# EasyEDA Pro project 鲲FOC无刷电机控制器.epro, schematic 驱动板
Create Date: 2023-12-31; Page Name: P1; Project Name: 鲲FOC无刷电机控制器（已适配灯哥开源FOC程序）; Schematic Name: 驱动板; Update Date: 2024-01-07; Company: 嘉立创EDA; Page Size: A4; Version: V1.0
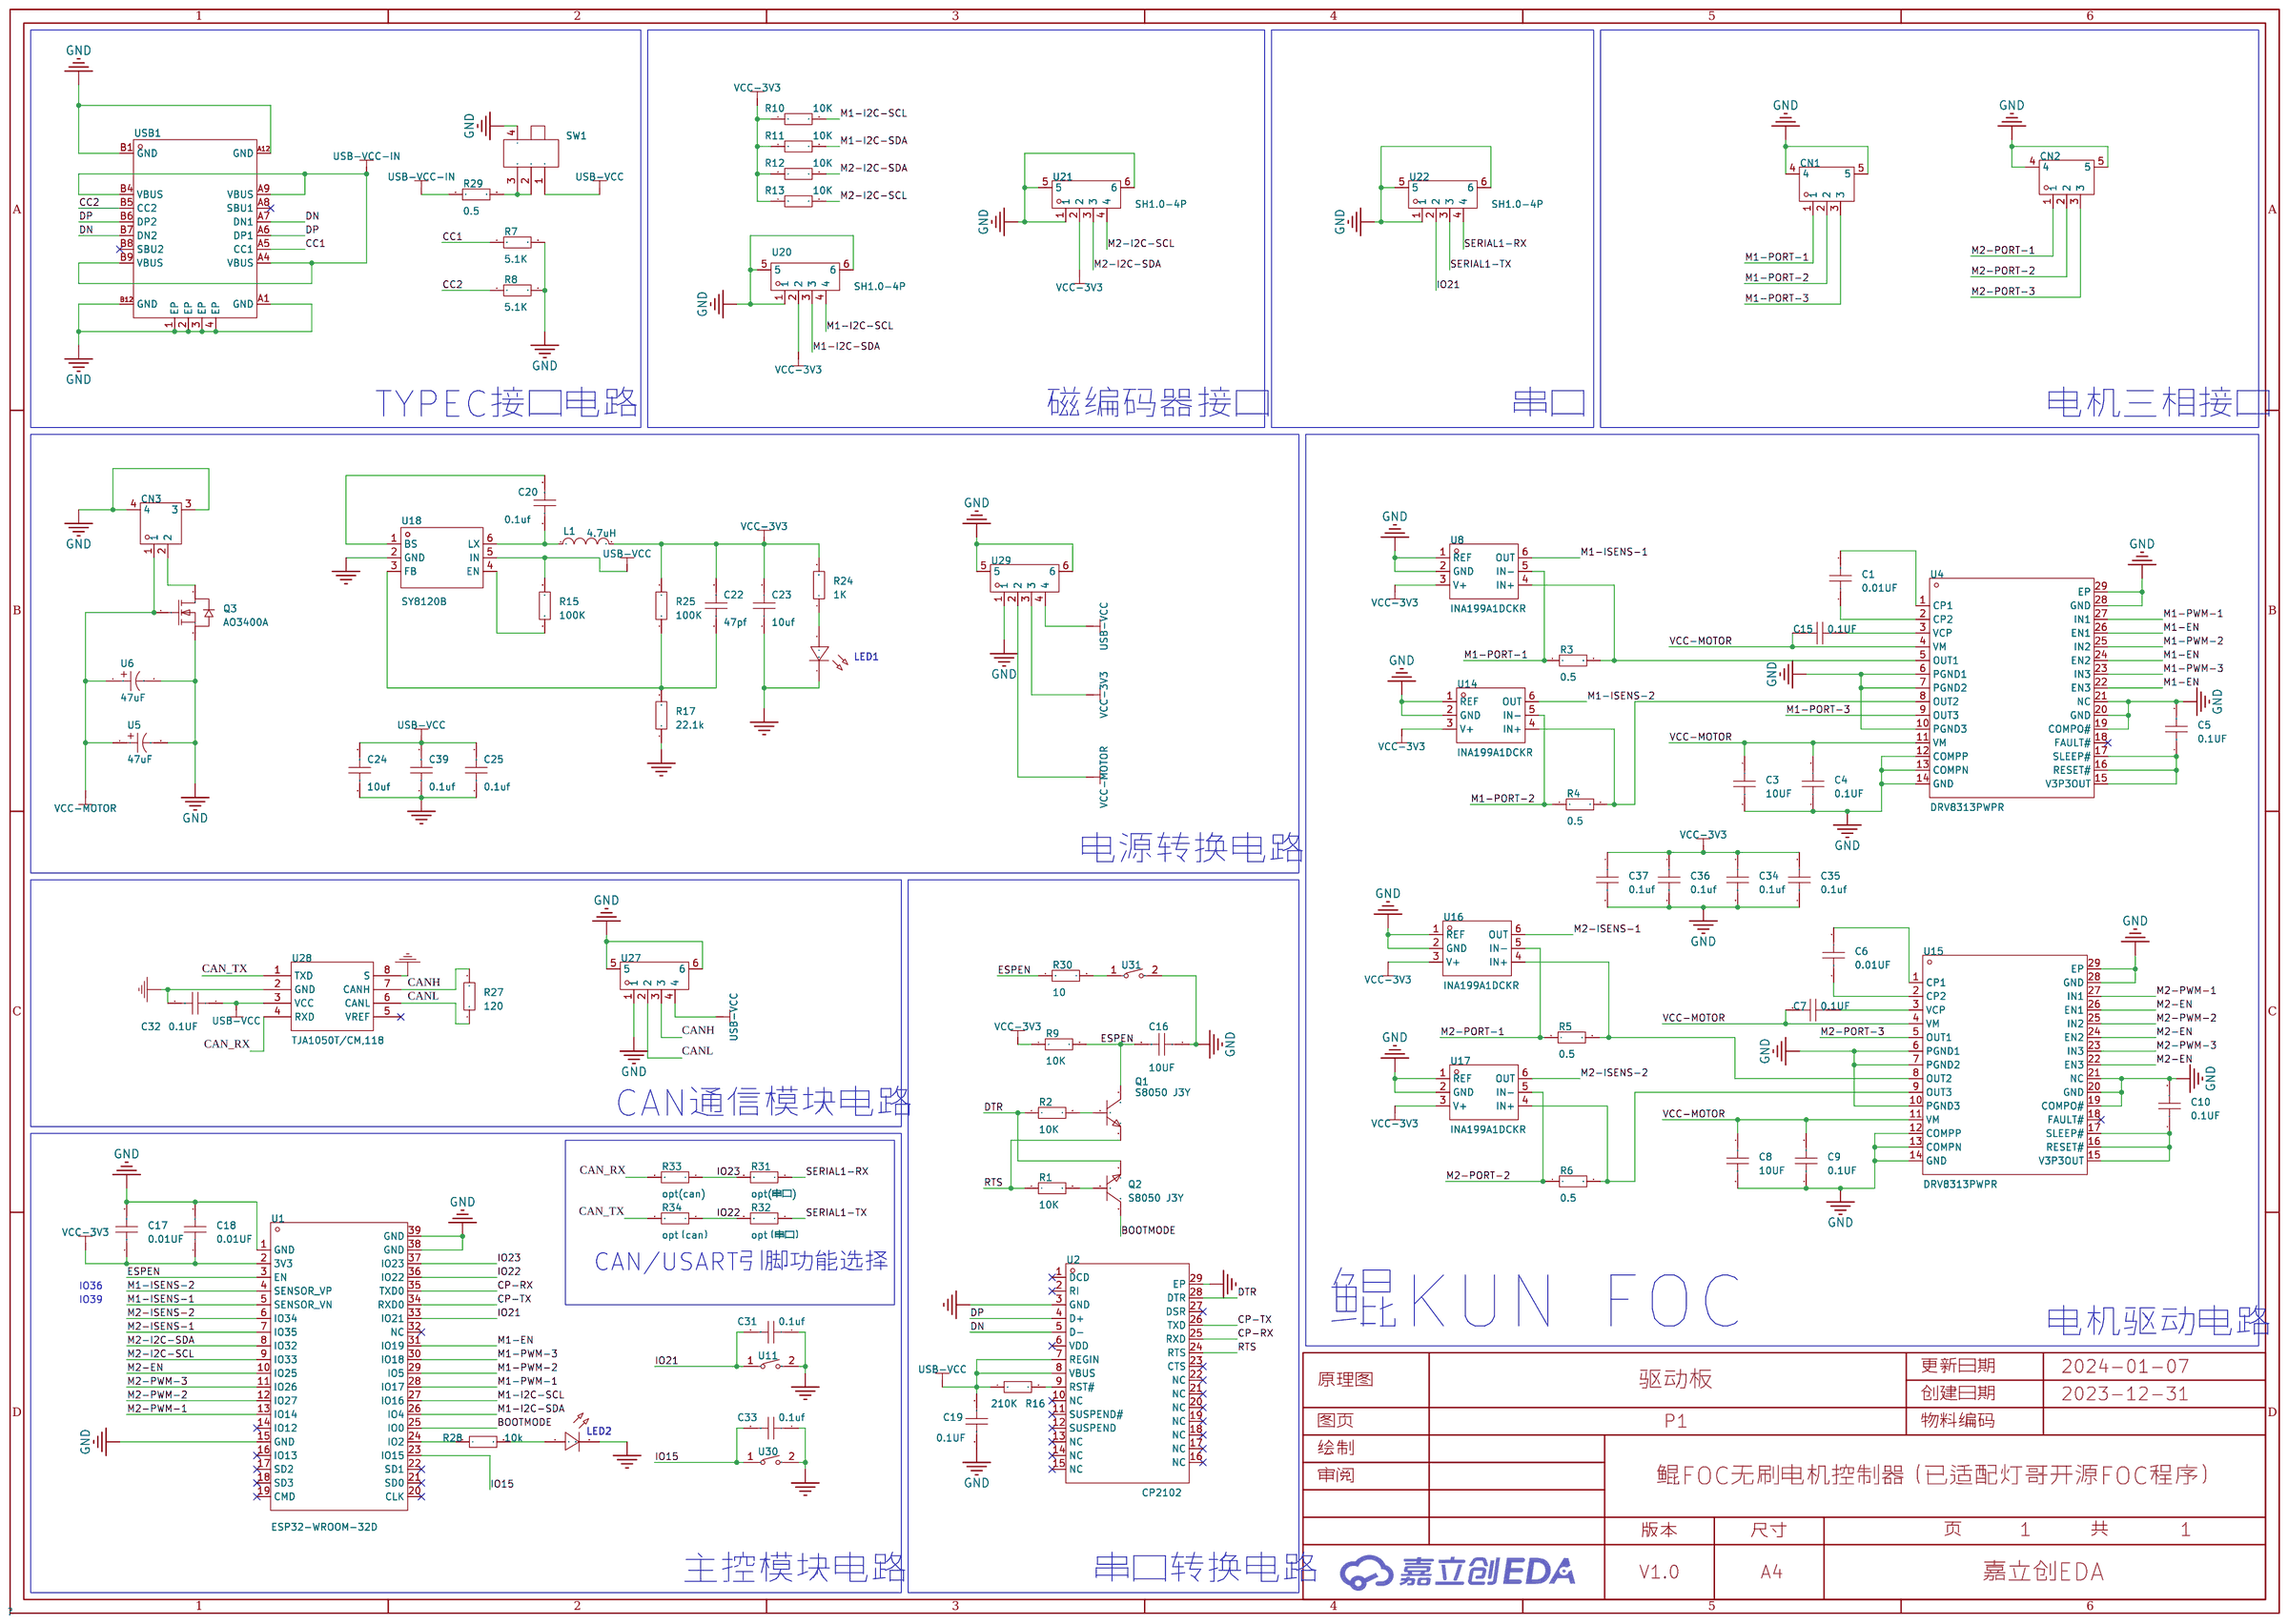
[diagram p1: schematic sheet]

## Parts
C1  0.01UF  [C0603]
C3  10UF  [C0603]
C4  0.1UF  [C0603]
C5  0.1UF  [C0603]
C6  0.01UF  [C0603]
C7  0.1UF  [C0603]
C8  10UF  [C0603]
C9  0.1UF  [C0603]
C10  0.1UF  [C0603]
C15  0.1UF  [C0603]
C16  10UF  [C0603]
C17  0.01UF  [C0603]
C18  0.01UF  [C0603]
C19  0.1UF  [C0603]
C20  0.1uf  [C0603]
C22  47pf  [C0603]
C23  10uf  [C0603]
C24  10uf  [C0603]
C25  0.1uf  [C0603]
C31  0.1uf  [C0603]
C32  0.1UF  [C0603]
C33  0.1uf  [C0603]
C34  0.1uf  [C0603]
C35  0.1uf  [C0603]
C36  0.1uf  [C0603]
C37  0.1uf  [C0603]
C39  0.1uf  [C0603]
CN1  MR30PW-F  [CONN-TH_MR30PW-F]
CN2  MR30PW-F  [CONN-TH_MR30PW-F]
CN3  XT30PW-M  [CONN-TH_XT30PW-M]
L1  4.7uH  [IND-SMD_L4.0-W4.0_FNR40XXS]
LED1  -  [LED_0603]
LED2  -  [LED_0603]
Q1  S8050 J3Y  [SOT-23-3_L3.0-W1.7-P0.95-LS2.9-BR]
Q2  S8050 J3Y  [SOT-23-3_L3.0-W1.7-P0.95-LS2.9-BR]
Q3  AO3400A  [SOT-23-3_L2.9-W1.6-P1.90-LS2.8-BR]
R1  10K  [R0603]
R2  10K  [R0603]
R3  0.5  [R1206]
R4  0.5  [R1206]
R5  0.5  [R1206]
R6  0.5  [R1206]
R7  5.1K  [R0603]
R8  5.1K  [R0603]
R9  10K  [R0603]
R10  10K  [R0603]
R11  10K  [R0603]
R12  10K  [R0603]
R13  10K  [R0603]
R15  100K  [R0603]
R16  210K  [R0603]
R17  22.1k  [R0603]
R24  1K  [R0603]
R25  100K  [R0603]
R27  120  [R0603]
R28  10k  [R0603]
R29  0.5  [R1206]
R30  10  [R0603]
R31  opt(串口)  [R0603]
R32  opt（串口）  [R0603]
R33  opt(can)  [R0603]
R34  opt（can）  [R0603]
SW1  MK-12C01-G1.5  [SW-SMD_DEALON_MK-12C01-G1.5]
U1  ESP32-WROOM-32D  [WIFIM-SMD_ESP32-WROOM-32D]
U2  CP2102  [QFN-28_L5.0-W5.0-P0.50-TL-EP3.2]
U4  DRV8313PWPR  [HTSSOP-28_L9.8-W4.5-P0.65-LS6.6-BL-EP]
U5  47uF  [cap-smd_bd5.0-l5.3-w5.3-ls5.7-fd]
U6  47uF  [cap-smd_bd5.0-l5.3-w5.3-ls5.7-fd]
U8  INA199A1DCKR  [SC-70-6_L2.0-W1.3-P0.65-LS2.1-BR]
U11  TC-S3403-2.0-260G  [SW-SMD_L4.0-W3.0-LS5.0]
U14  INA199A1DCKR  [SC-70-6_L2.0-W1.3-P0.65-LS2.1-BR]
U15  DRV8313PWPR  [HTSSOP-28_L9.8-W4.5-P0.65-LS6.6-BL-EP]
U16  INA199A1DCKR  [SC-70-6_L2.0-W1.3-P0.65-LS2.1-BR]
U17  INA199A1DCKR  [SC-70-6_L2.0-W1.3-P0.65-LS2.1-BR]
U18  SY8120B  [SOT-23-6_L2.9-W1.6-P0.95-LS2.8-BL]
U20  SH1.0-4P  [CONN-SMD_4P-P1.00_SH1.0-4P]
U21  SH1.0-4P  [CONN-SMD_4P-P1.00_SH1.0-4P]
U22  SH1.0-4P  [CONN-SMD_4P-P1.00_SH1.0-4P]
U27  SH1.0-4P  [CONN-SMD_4P-P1.00_SH1.0-4P]
U28  TJA1050T/CM,118  [SOIC-8_L5.0-W4.0-P1.27-LS6.0-BL]
U29  SH1.0-4P  [CONN-SMD_4P-P1.00_SH1.0-4P]
U30  TC-S3403-2.0-260G  [SW-SMD_L4.0-W3.0-LS5.0]
U31  TC-S3403-2.0-260G  [SW-SMD_L4.0-W3.0-LS5.0]
USB1  HC-TYPE-C-16P-01B  [USB-C-SMD_KH-TYPE-C-16P]

## Library data of the parts
C1 C3-C10 C15-C20 C22-C25 C31-C37 C39 = CAP_0805: Supplier Footprint: 0805
CN1 CN2 = MR30PW-F: Supplier Part: C2928110; Supplier Footprint: Through hole; JLCPCB Part Class: 扩展库; Supplier: LCSC
CN3 = XT30PW-M: Socket,DCsupply,XT30,male,PIN:2; LCSC Part Name: AMASS(艾迈斯)航模插头 卧式弯脚 XT30PW-M公头; Supplier Part: C431092; Manufacturer: AMASS(艾迈斯); JLCPCB Part Class: 扩展库; Datasheet: https://atta.szlcsc.com/upload/public/pdf/source/20220222/6A9F22F7850E25B33E1BE430ADF8560B.pdf; Supplier: LCSC
L1 = FNR4020S4R7MT: 电感值:4.7uH;精度:±20%;额定电流:1.34A;直流电阻(DCR):98mΩ;; LCSC Part Name: 4.7uH ±20% 1.34A 98mΩ; Supplier Part: C167828; Manufacturer: cjiang(长江微电); Supplier Footprint: SMD,4x4x2mm; JLCPCB Part Class: 扩展库; Datasheet: https://atta.szlcsc.com/upload/public/pdf/source/20190327/C167828_0C146B75E465FFC746F4145E84B3A0D4.pdf; Supplier: LCSC; Tolerance: ±20%; Rated Current: 1.34A; DC Resistance (DCR): 98mΩ
LED1 LED2 = LED_0603-G: Supplier Footprint: 0603
Q1 Q2 = S8050 J3Y_C2146: 晶体管类型:NPN;集射极击穿电压(Vceo):25V;集电极电流(Ic):500mA;功率(Pd):300mW;直流电流增益(hFE@Ic,Vce):200@50mA,1V;; LCSC Part Name: NPN 25V 500mA (200-350); Supplier Part: C2146; Manufacturer: CJ(江苏长电/长晶); Supplier Footprint: SOT-23; JLCPCB Part Class: 基础库; Datasheet: https://atta.szlcsc.com/upload/public/pdf/source/20140809/1457707209234.pdf; Supplier: LCSC; Transistor Type: NPN; Collector-Emitter Breakdown Voltage (Vceo): 25V; Collector Current (Ic): 500mA; Power Dissipation (Pd): 300mW; Collector Cut-Off Current (Icbo): 100nA; Collector-Emitter Saturation Voltage (VCE(sat)@Ic,Ib): 600mV@500mA,50mA; DC Current Gain (hFE@Ic,Vce): 200@50mA,1V; Transition Frequency (fT): 150MHz; Operating Temperature: +150℃@(Tj)
Q3 = AO3400A_C20917: 类型:N沟道;漏源电压(Vdss):30V;连续漏极电流(Id):5.7A;功率(Pd):1.4W;导通电阻(RDS(on)@Vgs,Id):26.5mΩ@10V,5.7A;; LCSC Part Name: N沟道 30V 5.7A; Supplier Part: C20917; Manufacturer: AOS; Supplier Footprint: SOT-23-3L; JLCPCB Part Class: 基础库; Datasheet: https://atta.szlcsc.com/upload/public/pdf/source/20140107/1457706668533.pdf; Supplier: LCSC; Type: N沟道; Drain Source Voltage (Vdss): 30V; Continuous Drain Current (Id): 5.7A; Power Dissipation (Pd): 1.4W; Drain Source On Resistance (RDS(on)@Vgs,Id): 26.5mΩ@10V,5.7A; Gate Threshold Voltage (Vgs(th)@Id): 1.5V@250uA
R1 R2 R7-R13 R15 R17 R24 R25 R27 R28 R30-R34 = Res_0805: Supplier Footprint: 0805
R3-R6 R29 = Res_1206: Supplier Footprint: 1206
R16 = Res_0603: Supplier Footprint: 0603
SW1 = MK-12C01-G1.5: LCSC Part Name: 微型拨动开关; Supplier Part: C2904924; Manufacturer: DEALON(德艺隆); Supplier Footprint: SMD; Datasheet: https://atta.szlcsc.com/upload/public/pdf/source/20220901/95C663E2ADD105B13B25A040498EDC42.pdf; Supplier: LCSC
U1 = ESP32-WROOM-32D: Supplier Part: C503588; Supplier Footprint: Module; Datasheet: https://atta.szlcsc.com/upload/public/pdf/source/20200407/C503588_9E920733859C3E86D4243CAB277EC877.pdf; Supplier: LCSC
U2 = CP2102: Supplier Part: C9900004371; Supplier Footprint: QFN-28_L5.0-W5.0-P0.50-EP3.2; JLCPCB Part Class: Extended Part; Supplier: LCSC
U4 U15 = DRV8313PWPR: 类型:无刷直流BLDC;电源电压:8V~60V;输出电流:-;接口:并行;; Supplier Part: C92482; Manufacturer: TI(德州仪器); Supplier Footprint: HTSSOP-28-EP-4.5mm; JLCPCB Part Class: 扩展库; Datasheet: https://atta.szlcsc.com/upload/public/pdf/source/20180307/C92482_15204091381071407760.pdf; Supplier: LCSC; Type: 无刷直流BLDC; Supply Voltage: 8V~60V; Interface: 并行; Operating Temperature: -40℃~+150℃@(Tj)
U5 U6 = UUL1C220MCL1GS: 容值:22uF;精度:±20%;额定电压:16V;电容体直径:5mm;电容体长度:5.8mm;纹波电流:30mA@120Hz;等效串联电阻:-;工作寿命:5000hrs@105℃;工作温度:-40℃~+105℃;; LCSC Part Name: 22uF ±20% 16V; Supplier Part: C2162916; Manufacturer: Nichicon(尼吉康); Supplier Footprint: SMD,D5xL5.8mm; JLCPCB Part Class: Extended Part; Datasheet: https://atta.szlcsc.com/upload/public/pdf/source/20211025/5FD45B81DB3BCF3AFF7B715067C047C8.pdf; Supplier: LCSC; Tolerance: ±20%; Rated Voltage: 16V; φD: 5mm; L: 5.8mm; Ripple Current: 30mA@120Hz; Lifetime @ Temp: 5000hrs@105℃; Operating Temperature: -40℃~+105℃
U8 U14 U16 U17 = INA199B1DCKR: INA199 26V、双向、零漂移、低侧/高侧、电压输出分流监控器; Supplier Part: C398920; Manufacturer: TI(德州仪器); Supplier Footprint: SC-70-6; JLCPCB Part Class: 扩展库; Datasheet: https://atta.szlcsc.com/upload/public/pdf/source/20190618/C398920_11F1AA1C0E9C9D9BC4E845E2D57884D2.pdf; Supplier: LCSC
U11 U30 U31 = TC-S3403-2.0-260G: 连接器类型：3.5mm耳机座 额定电流：500mA 额定电压：30V 工作温度范围：-20℃~+70℃ 焊接温度(最大值)：235℃ 3.5音频连接器 5脚3级插脚 音响耳机插座; Supplier Part: C5372844; Manufacturer: HCTL(华灿天禄); Supplier Footprint: SMD; Datasheet: https://atta.szlcsc.com/upload/public/pdf/source/20230320/549E467C3F97F31F1E4EF0A0B79060CE.pdf; Supplier: LCSC
U18 = SY8120B: LCSC Part Name: 2A, 18V, 600KHz同步降压转换器; Supplier Part: C5330397; Manufacturer: Slkor(萨科微); Supplier Footprint: SOT-23-6; Datasheet: https://atta.szlcsc.com/upload/public/pdf/source/20221213/05E3E36F9B4BD6CBAE1D86C5271B65DD.pdf; Supplier: LCSC
U20-U22 U27 U29 = SH1.0-4P: Supplier Part: C9900023784; Supplier Footprint: CONN-SMD-4P; JLCPCB Part Class: 扩展库; Supplier: LCSC
U28 = TJA1050T/CM,118: 类型:收发器;; LCSC Part Name: 4.75V~5.25V; Supplier Part: C6952; Manufacturer: NXP(恩智浦); Supplier Footprint: SOIC-8; Datasheet: https://atta.szlcsc.com/upload/public/pdf/source/20140411/1457707042917.pdf; Supplier: LCSC; Type: 收发器; Supply Voltage: 4.75V~5.25V; Supply Current: 50mA
USB1 = HC-TYPE-C-16P-01B: 连接器类型:Type-C;标准:-;公母:母座;触点数量:16;端口数量:1;安装方式:卧贴;额定电流 - 电源:3A;触头材质:铜;触头镀层:金;工作温度范围:-25℃~+85℃;焊接温度(最大值):260℃;; LCSC Part Name: Type-C 母座 卧贴; Supplier Part: C2894898; Manufacturer: HCTL(华灿天禄); Supplier Footprint: SMD; JLCPCB Part Class: Extended Part; Datasheet: https://atta.szlcsc.com/upload/public/pdf/source/20221116/A0A1FBB0E7A834DC9555AEBAA987625F.pdf; Supplier: LCSC; Connector Type: Type-C; Gender: 母座; Number of Contacts: 16; Number of Ports: 1; Mounting Style: 卧贴; Current Rating - Power (Max): 3A; Contact Material: 铜; Contact Plating: 金; Operating Temperature Range: -25℃~+85℃; Welding Temperature (Max): 260℃

## Nets
GND: C3.2 C4.1 C5.2 C8.2 C9.1 C10.2 C16.1 C17.2 C18.2 C19.1 C23.1 C24.1 C25.1 C31.1 C32.2 C33.1 C34.2 C35.1 C36.2 C37.2 C39.1 CN1.4 CN1.5 CN2.4 CN2.5 CN3.3 CN3.4 LED1.1(C) LED2.1(C) Q3.2(S) R7.2 R8.2 R17.1 SW1.4 U1.1(GND) U1.15(GND) U1.38(GND) U1.39(GND) U2.3(GND) U2.29(EP) U4.6(PGND1) U4.7(PGND2) U4.10(PGND3) U4.12(COMPP) U4.13(COMPN) U4.14(GND) U4.19(COMPO#) U4.20(GND) U4.21(NC) U4.28(GND) U4.29(EP) U5.2 U6.2 U8.1(REF) U8.2(GND) U11.2 U14.1(REF) U14.2(GND) U15.6(PGND1) U15.7(PGND2) U15.10(PGND3) U15.12(COMPP) U15.13(COMPN) U15.14(GND) U15.19(COMPO#) U15.20(GND) U15.21(NC) U15.28(GND) U15.29(EP) U16.1(REF) U16.2(GND) U17.1(REF) U17.2(GND) U18.2(GND) U20.1 U20.5 U20.6 U21.1 U21.5 U21.6 U22.1 U22.5 U22.6 U27.1 U27.5 U27.6 U28.2(GND) U28.8(S) U29.1 U29.5 U29.6 U30.2 U31.2 USB1.1(EP) USB1.2(EP) USB1.3(EP) USB1.4(EP) USB1.A1(GND) USB1.A12(GND) USB1.B1(GND) USB1.B12(GND)
VCC-3V3: C17.1 C18.1 C22.2 C23.2 C34.1 C35.2 C36.1 C37.1 L1.2 R9.1 R10.1 R11.1 R12.1 R13.1 R24.2 R25.2 U1.2(3V3) U8.3(V+) U14.3(V+) U16.3(V+) U17.3(V+) U20.2 U21.2 U29.3
VCC-MOTOR: C3.1 C4.2 C7.2 C8.1 C9.2 C15.2 CN3.1 Q3.1(G) U4.4(VM) U4.11(VM) U5.1 U6.1 U15.4(VM) U15.11(VM) U29.2
BOOTMODE: Q2.3(C) U1.25(IO0)
CAN_RX: R33.2 U28.4(RXD)
CAN_TX: R34.2 U28.1(TXD)
CANH: R27.2 U27.3 U28.7(CANH)
CANL: R27.1 U27.2 U28.6(CANL)
CC1: R7.1 USB1.A5(CC1)
CC2: R8.1 USB1.B5(CC2)
CP-RX: U1.35(TXD0) U2.25(RXD)
CP-TX: U1.34(RXD0) U2.26(TXD)
DN: U2.5(D-) USB1.A7(DN1) USB1.B7(DN2)
DP: U2.4(D+) USB1.A6(DP1) USB1.B6(DP2)
DTR: Q2.2(E) R2.1 U2.28(DTR)
ESPEN: C16.2 Q1.3(C) R9.2 R30.1 U1.3(EN)
IO15: C33.2 U1.23(IO15) U30.1
IO21: C31.2 U1.33(IO21) U11.1 U22.2
IO22: R32.2 R34.1 U1.36(IO22)
IO23: R31.2 R33.1 U1.37(IO23)
M1-EN: U1.31(IO19) U4.22(EN3) U4.24(EN2) U4.26(EN1)
M1-I2C-SCL: R10.2 U1.27(IO16) U20.4
M1-I2C-SDA: R11.2 U1.26(IO4) U20.3
M1-ISENS-1: U1.5(SENSOR_VN) U8.6(OUT)
M1-ISENS-2: U1.4(SENSOR_VP) U14.6(OUT)
M1-PORT-1: CN1.1 R3.1 U8.5(IN-)
M1-PORT-2: CN1.2 R4.1 U14.5(IN-)
M1-PORT-3: CN1.3 U4.9(OUT3)
M1-PWM-1: U1.28(IO17) U4.27(IN1)
M1-PWM-2: U1.29(IO5) U4.25(IN2)
M1-PWM-3: U1.30(IO18) U4.23(IN3)
M2-EN: U1.10(IO25) U15.22(EN3) U15.24(EN2) U15.26(EN1)
M2-I2C-SCL: R13.2 U1.9(IO33) U21.4
M2-I2C-SDA: R12.2 U1.8(IO32) U21.3
M2-ISENS-1: U1.7(IO35) U16.6(OUT)
M2-ISENS-2: U1.6(IO34) U17.6(OUT)
M2-PORT-1: CN2.1 R5.1 U16.5(IN-)
M2-PORT-2: CN2.2 R6.1 U17.5(IN-)
M2-PORT-3: CN2.3 U15.5(OUT1)
M2-PWM-1: U1.13(IO14) U15.27(IN1)
M2-PWM-2: U1.12(IO27) U15.25(IN2)
M2-PWM-3: U1.11(IO26) U15.23(IN3)
RTS: Q1.2(E) R1.1 U2.24(RTS)
SERIAL1-RX: R31.1 U22.4
SERIAL1-TX: R32.1 U22.3
USB-VCC: C19.2 C24.2 C25.2 C32.1 C39.2 R15.2 R16.1 SW1.1 U2.7(REGIN) U2.8(VBUS) U18.5(IN) U27.4 U28.3(VCC) U29.4
USB-VCC-IN: R29.1 USB1.A4(VBUS) USB1.A9(VBUS) USB1.B4(VBUS) USB1.B9(VBUS)
$1N2980: C1.2 U4.1(CP1)
$1N3181: C5.1 U4.15(V3P3OUT) U4.16(RESET#) U4.17(SLEEP#)
$1N4042: C6.1 U15.2(CP2)
$1N4045: C6.2 U15.1(CP1)
$1N4048: C7.1 U15.3(VCP)
$1N4078: C10.1 U15.15(V3P3OUT) U15.16(RESET#) U15.17(SLEEP#)
$1N4426: C15.1 U4.3(VCP)
$1N4427: C1.1 U4.2(CP2)
$1N4623: Q1.1(B) R2.2
$1N6446: R16.2 U2.9(RST#)
$1N8080: C20.1 L1.1 U18.6(LX)
$1N8081: C20.2 U18.1(BS)
$1N8085: R15.1 U18.4(EN)
$1N8086: C22.1 R17.2 R25.1 U18.3(FB)
$1N8089: LED1.2(A) R24.1
$1N8297: CN3.2 Q3.3(D)
$1N11309: R28.1 U1.24(IO2)
$1N11631: R29.2 SW1.2 SW1.3
$1N13545: R30.2 U31.1
$1N13626: LED2.2(A) R28.2
$1N21768: Q2.1(B) R1.2
$1N28692: R5.2 U15.8(OUT2) U16.4(IN+)
$1N28778: R6.2 U15.9(OUT3) U17.4(IN+)
$1N28818: R3.2 U4.5(OUT1) U8.4(IN+)
$1N28837: R4.2 U4.8(OUT2) U14.4(IN+)

Not connected (* = marked no-connect by the designer): U1 14(IO12)* 16(IO13)* 17(SD2)* 18(SD3)* 19(CMD)* 20(CLK)* 21(SD0)* 22(SD1)* 32(NC)*; U2 1(DCD)* 2(RI)* 6(VDD)* 10(NC)* 11(SUSPEND#)* 12(SUSPEND)* 13(NC)* 14(NC)* 15(NC)* 16(NC)* 17(NC)* 18(NC)* 19(NC)* 20(NC)* 21(NC)* 22(NC)* 23(CTS)* 27(DSR)*; U4 18(FAULT#)*; U15 18(FAULT#)*; U28 5(VREF)*; USB1 A8(SBU1)* B8(SBU2)*

## Notes on the sheet
- TYPEC接口电路
- 磁编码器接口
- 串口
- 电机三相接口
- 电源转换电路
- CAN通信模块电路
- CAN/USART引脚功能选择
- IO36
- IO39
- 鲲KUN FOC
- 电机驱动电路
- 主控模块电路
- 串口转换电路
